# EAGLE design 902_kerberos (EAGLE 8.2.2)
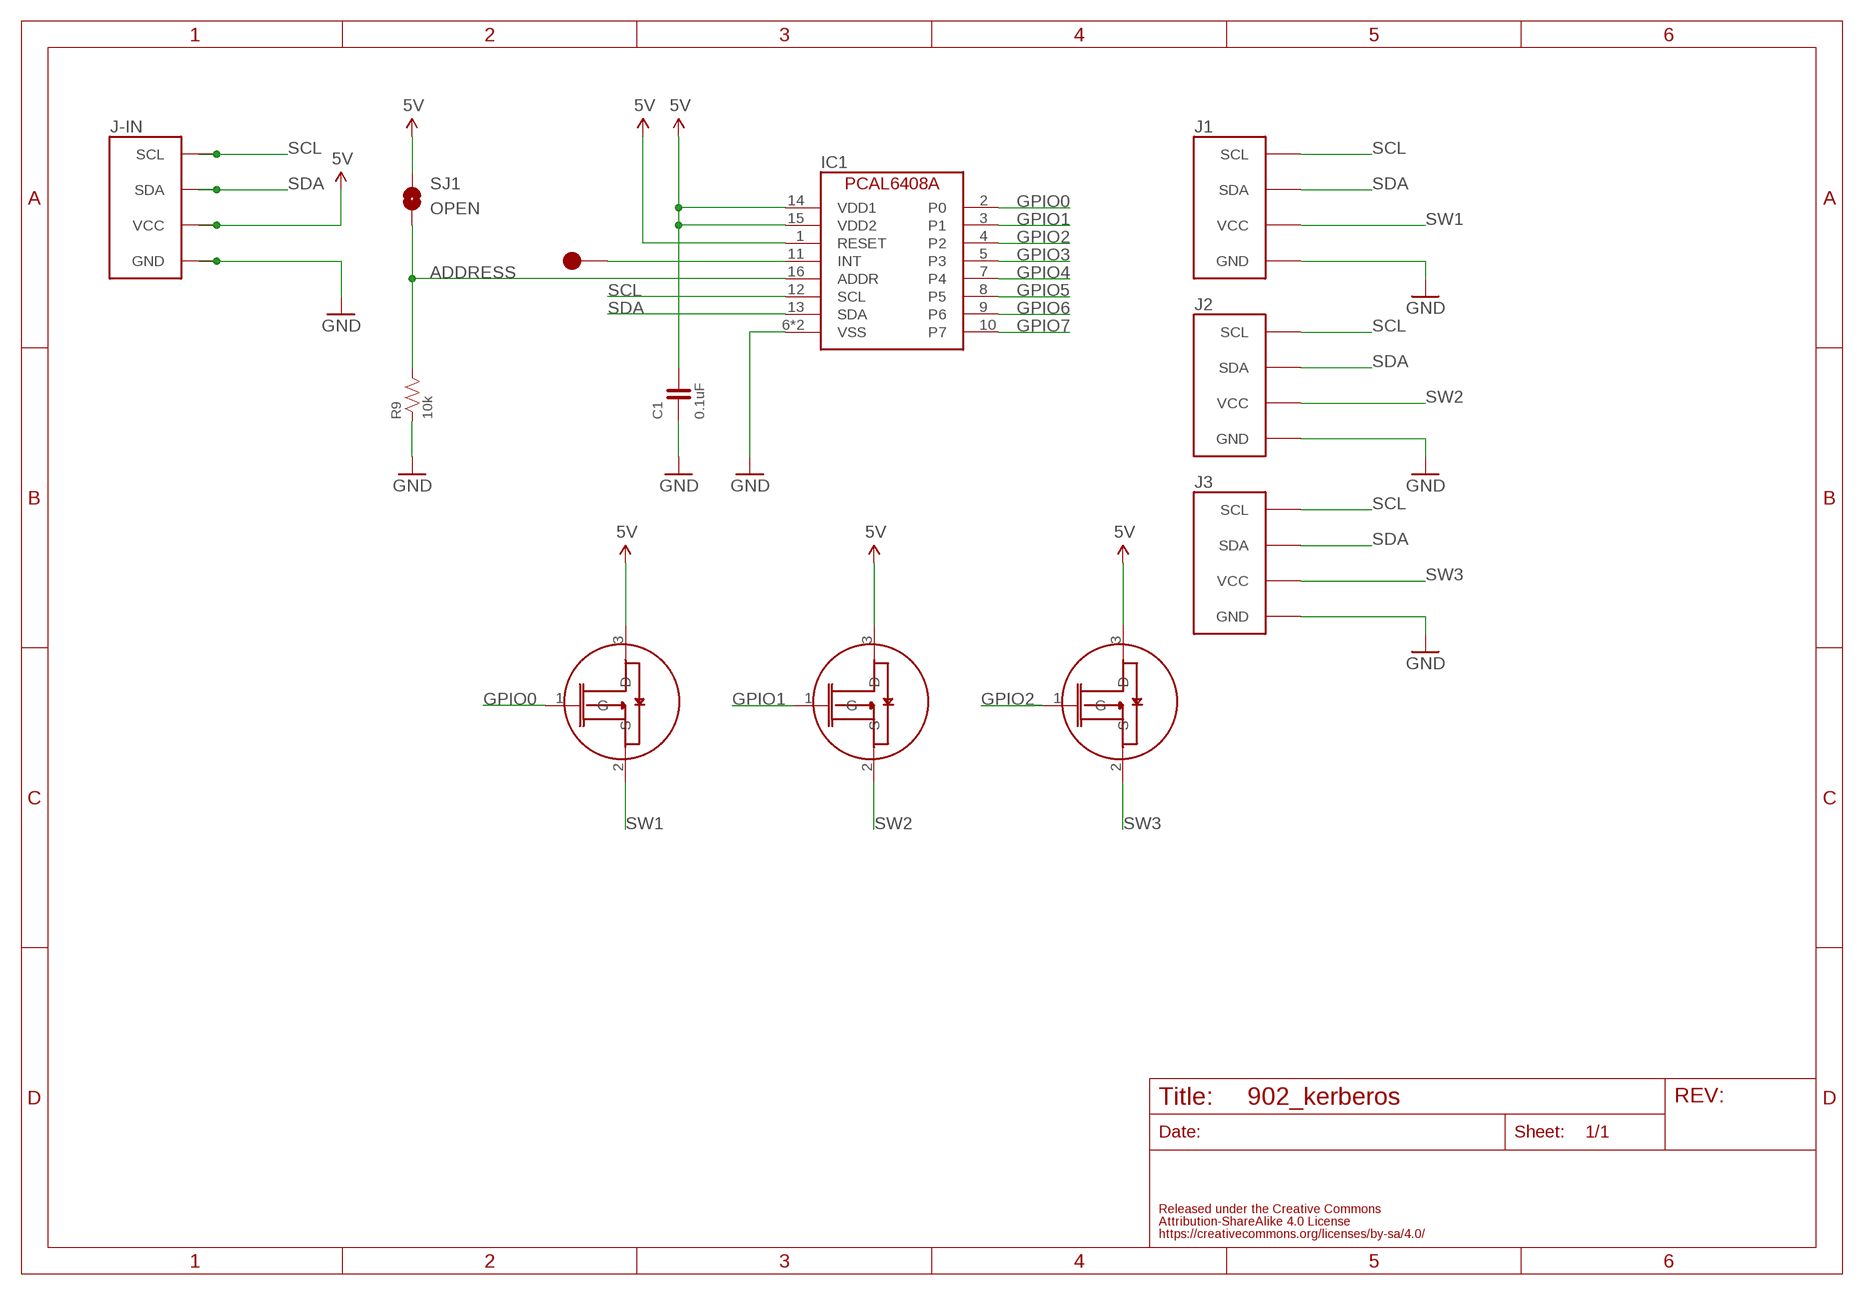
[diagram p0: schematic, sheet 1]

## Parts
C1  0.1uF  CAPACITOR-0603  [0603]
IC1  NX-PCAL6408A  [NXP-PCAL6408A]
J1  FABO_BRICK_I2C-S04B-PASK-2  [FABO_BRICK_I2C_S04B-PASK-2]
J2  FABO_BRICK_I2C-S04B-PASK-2  [FABO_BRICK_I2C_S04B-PASK-2]
J3  FABO_BRICK_I2C-S04B-PASK-2  [FABO_BRICK_I2C_S04B-PASK-2]
J-IN  FABO_BRICK_I2C-S04B-PASK-2  [FABO_BRICK_I2C_S04B-PASK-2]
R9  10k  RESISTOR-0603-NARROW  [0603-NARROW]
SJ1  OPEN  SMD-JUMPER-2-OPEN  [SMD-JUMPER-2-OPEN]
SW1  FAIRCHILD-FDN338  [SOT23]
SW2  FAIRCHILD-FDN338  [SOT23]
SW3  FAIRCHILD-FDN338  [SOT23]
TP1  TP-15  [TP-15]

## Nets
5V: C1.2 IC1.1(RESET) IC1.14(VDD1) IC1.15(VDD2) J-IN.VCC SJ1.1 SW1.3(D) SW2.3(D) SW3.3(D)
ADDRESS: IC1.16(ADDR) R9.2 SJ1.2
GND: C1.1 IC1.6(VSS) IC1.17(VSS) J1.GND J3.GND J-IN.GND R9.1
GPIO0: IC1.2(P0) SW1.1(G)
GPIO1: IC1.3(P1) SW2.1(G)
GPIO2: IC1.4(P2) SW3.1(G)
GPIO3: IC1.5(P3)
GPIO4: IC1.7(P4)
GPIO5: IC1.8(P5)
GPIO6: IC1.9(P6)
GPIO7: IC1.10(P7)
INT: IC1.11(INT) TP1.1
N$4: J2.GND ; supply symbol labelled GND
SCL: IC1.12(SCL) J1.SCL J2.SCL J3.SCL J-IN.SCL
SDA: IC1.13(SDA) J1.SDA J2.SDA J3.SDA J-IN.SDA
SW1: J1.VCC SW1.2(S)
SW2: J2.VCC SW2.2(S)
SW3: J3.VCC SW3.2(S)

## Library data of the parts
C1 = FaBo-Capacitor:CAPACITOR: CAPACITOR
IC1 = FaBo-Mems:NX-PCAL6408A: NXP PCAL6408A
J1-J3 J-IN = FaBo-Template:FABO_BRICK_I2C: FaBo Brick I2C
R9 = FaBo-Resistors:RESISTOR: RESISTOR
SJ1 = FaBo-Supply:SMD-JUMPER-2
SW1-SW3 = FaBo-Parts:FAIRCHILD-FDN338
TP1 = FaBo-Supply:TP

## Board
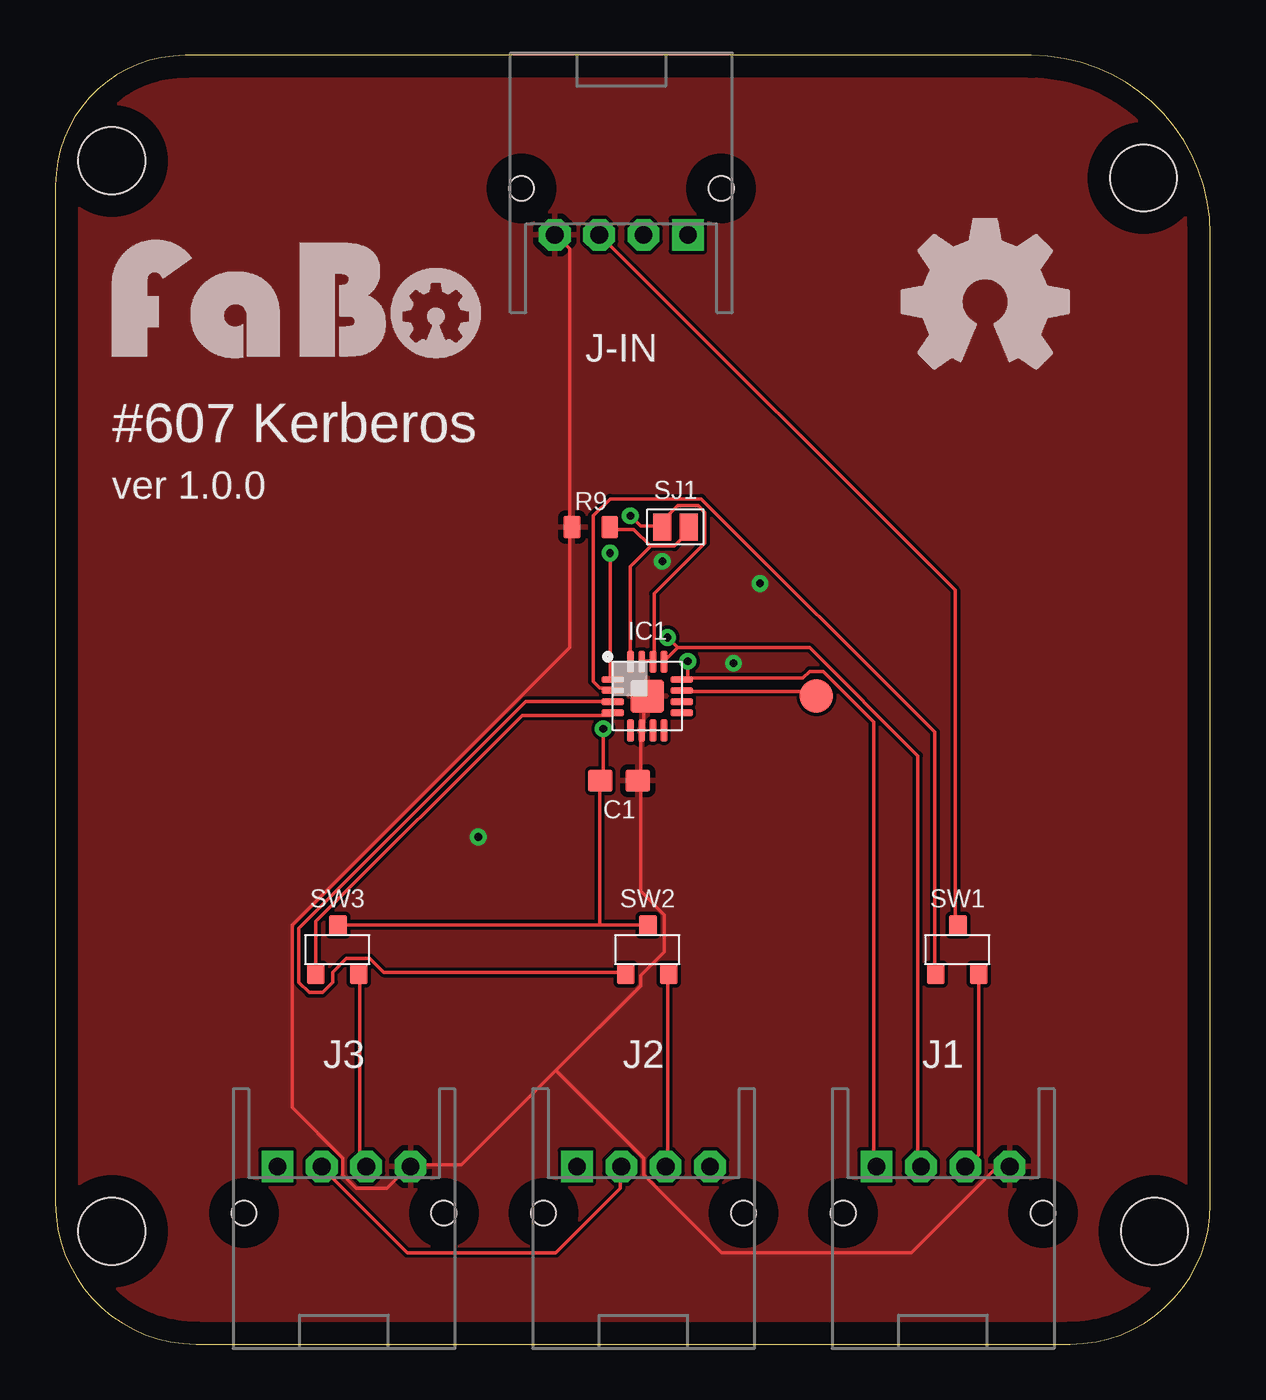
[diagram p1: board, top side]
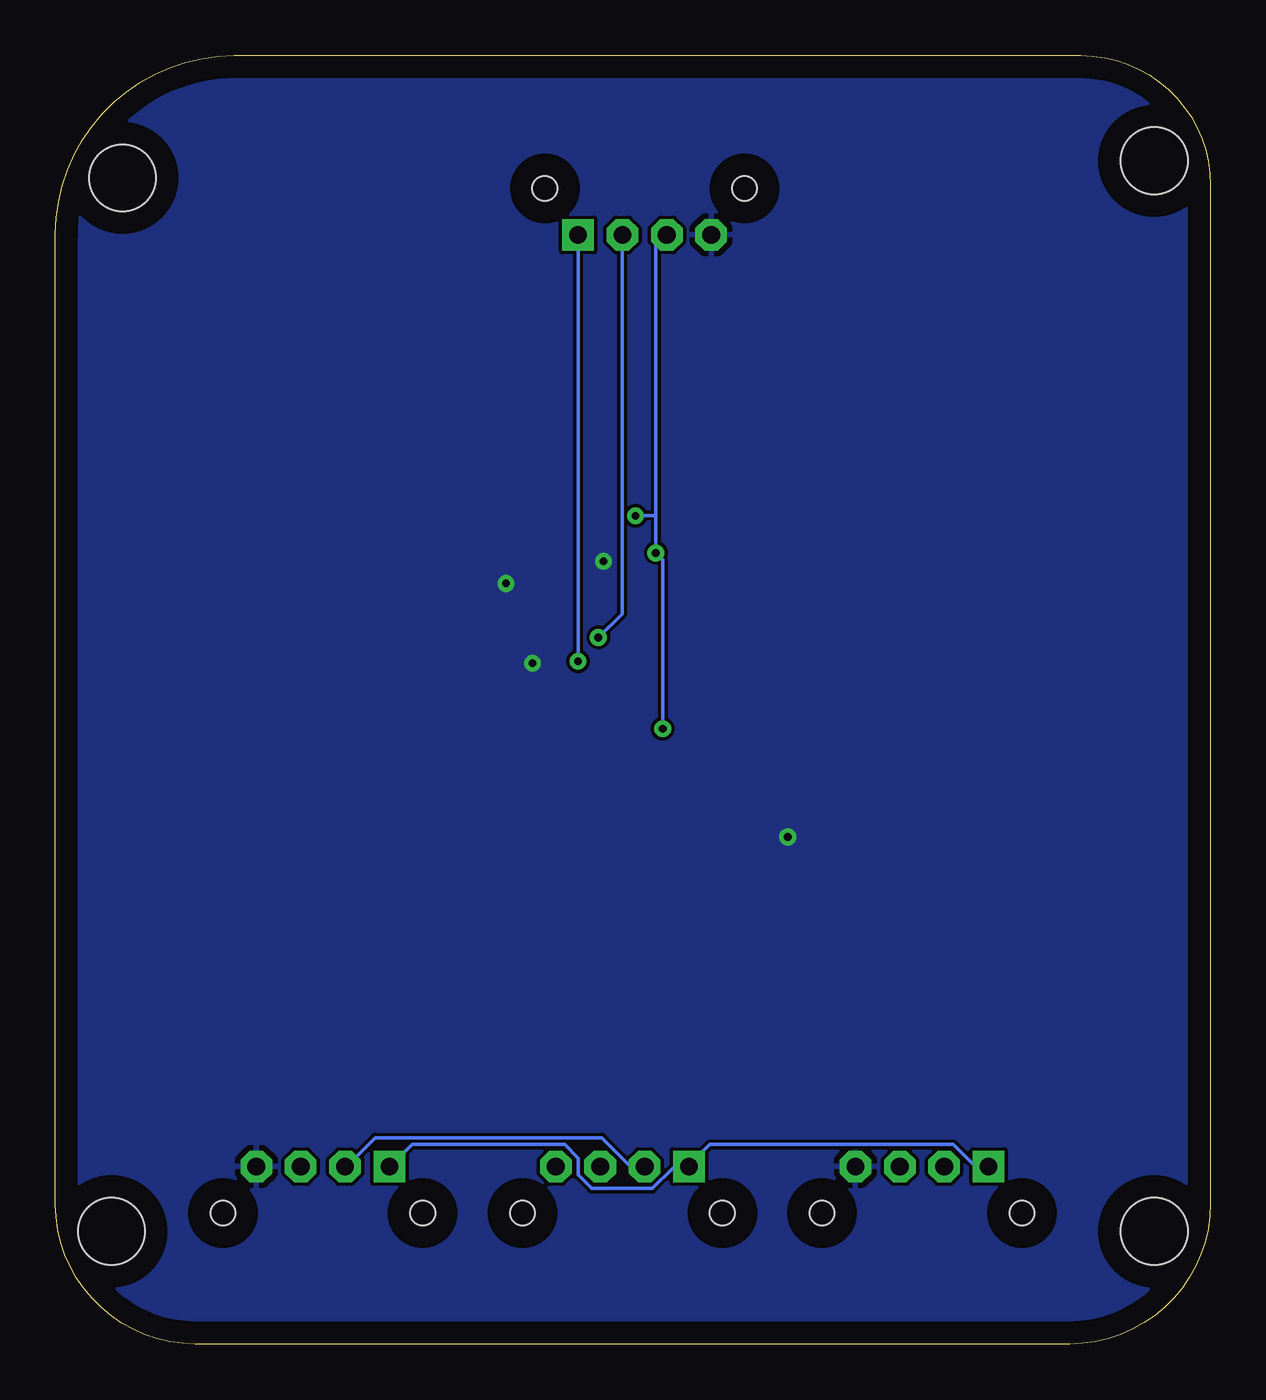
[diagram p2: board, bottom side, seen from below]

Size 52.05 x 58.09 mm. Coordinates in mm from the lower left corner, seen from the top.
Outline: 0,52.24 0,6.35 arc90 6.35,0 45.74,0 arc90 52.05,6.31 52.05,50.02 arc90 43.98,58.09 5.85,58.09 arc90 0,52.24
Copper layers (1*16): Top 0.035mm / dielectric 1.5mm / Bottom 0.035mm
Design rules "default": minimum track width 6mil, minimum drill 0.35mm, track to track 6mil, track to pad 6mil, pad to pad 6mil, via to via 6mil, smd to smd 6mil, copper to edge 40mil, drill to drill 6mil, minimum pad ring 10mil, minimum via ring 8mil, stop-mask expansion 4mil, vias tented up to drill 0mil, thermal gap 10mil
Holes 3 mm at 2.54,53.34 49.03,52.57 49.53,5.08 2.54,5.08

### Footprints (pad centres in the part's own frame; a part is rotated, then mirrored left to right if it is on the bottom)
0603 = smd 1.1 x 1: 1 -0.85,0; 2 0.85,0
NXP-PCAL6408A = smd 1 x 0.3: 1 -1.55,0.75; 2 -1.55,0.25; 3 -1.55,-0.25; 4 -1.55,-0.75; 9 1.55,-0.75; 10 1.55,-0.25; 11 1.55,0.25; 12 1.55,0.75 | smd 0.3 x 1: 5 -0.75,-1.55; 6 -0.25,-1.55; 7 0.25,-1.55; 8 0.75,-1.55; 13 0.75,1.55; 14 0.25,1.55; 15 -0.25,1.55; 16 -0.75,1.55 | smd 1.5 x 1.5: 17 0,0
FABO_BRICK_I2C_S04B-PASK-2 = drill 0.8 pad 1.422 octagon: GND -3,0; SDA 1,0; VCC -1,0 | drill 0.8 pad 1.422 square: SCL 3,0 | hole 1.1: 4.5,2.1; -4.5,2.1
0603-NARROW = smd 0.75 x 1: 1 -0.85,0; 2 0.85,0
SMD-JUMPER-2-OPEN = smd 0.8 x 1.2: 1 -0.6,0; 2 0.6,0
SOT23 = smd 0.8 x 0.9: 1 -0.97,-1.1; 2 0.97,-1.1; 3 0.03,1.1
TP-15 = smd 1.5 x 1.5: 1 0,0

### Placement (x,y rotation side)
C1  25.4,25.4 180 top
IC1  26.67,29.21 0 top
J1  40,8 180 top
J2  26.5,8 180 top
J3  13,8 180 top
J-IN  25.5,50 0 top
R9  24.13,36.83 0 top
SJ1  27.94,36.83 0 top
SW1  40.64,17.78 0 top
SW2  26.67,17.78 0 top
SW3  12.7,17.78 0 top
TP1  34.29,29.21 0 top
U$2  [LOGO_FABO_L]  10.16,44.45 0 top
U$3  [LOGO_OSHW_L]  41.91,46.99 0 top

### Tracks (layer width: path | path; a pad name or v marks a point on that pad's centre or on a via)
5V  (via drill 0.35)
  Top 0.152: 24.54,18.9 26.67,18.9 SW2.3 | 24.54,18.9 12.8,18.9 SW3.3 | 24.54,18.9 24.54,25.3 C1.2 24.69,25.45 v24.69,27.74 | IC1.15 26.52,30.79 26.82,30.79 IC1.14 26.98,30.79 26.98,33.83 29.26,36.12 29.26,37.49 28.96,37.8 28.04,37.8 27.43,37.19 27.43,36.88 SJ1.1 27.28,36.88 26.36,36.88 v25.91,37.34 | SW1.3 40.54,18.9 40.54,33.98 24.54,49.99 J-IN.VCC | v24.99,35.66 24.99,30.02 IC1.1
  Bottom 0.152: 24.99,37.34 24.99,49.53 24.54,49.99 J-IN.VCC | 24.99,37.34 v24.99,35.66 24.69,35.36 v24.69,27.74 | 24.99,37.34 v25.91,37.34
ADDRESS
  Top 0.152: 26.82,35.97 26.06,36.73 24.99,36.73 R9.2 | 26.82,35.97 27.89,35.97 28.65,36.73 SJ1.2 | 26.82,35.97 25.91,35.05 25.91,30.79 IC1.16
GND  (via drill 0.35)
  Top 0.152: J-IN.GND 22.55,49.99 23.16,49.38 23.16,36.88 R9.1 23.16,36.73 23.16,31.39 10.67,18.9 10.67,10.67 12.95,8.38 12.95,7.62 13.56,7.01 14.94,7.01 15.85,7.92 J3.GND 16,8.08 18.29,8.08 22.55,12.34 | IC1.17 26.67,29.11 26.52,28.96 26.52,27.74 IC1.6 26.36,27.58 26.36,25.45 C1.1 26.36,25.3 26.36,20.42 27.43,19.36 27.43,17.68 26.36,16.61 26.36,16.15 22.55,12.34 | 22.55,12.34 26.52,8.38 26.52,7.62 30.02,4.12 38.56,4.12 42.37,7.92 42.98,7.92 J1.GND
  other vias: 19.05,22.86 31.75,34.29 27.35,35.29 30.55,30.69
  pour Bottom: 0,0 52.07,0 52.07,58.42 0,58.42
  pour Top: 0,0 52.07,0 52.07,58.42 0,58.42
GPIO0
  Top 0.152: SW1.1 39.62,16.76 39.62,27.58 29.11,38.1 24.99,38.1 24.23,37.34 24.23,29.87 24.54,29.57 24.99,29.57 IC1.2
GPIO1
  Top 0.152: SW2.1 25.6,16.76 14.78,16.76 14.17,17.37 13.11,17.37 12.5,16.76 12.5,16.31 12.04,15.85 11.43,15.85 10.97,16.31 10.97,18.75 21.18,28.96 24.99,28.96 IC1.3
GPIO2
  Top 0.152: SW3.1 11.73,16.76 11.73,19.05 21.03,28.35 24.99,28.35 IC1.4
INT
  Top 0.152: IC1.11 28.35,29.41 34.14,29.41 34.29,29.26 TP1.1
SCL  (via drill 0.35)
  Top 0.152: 28.5,30.02 33.68,30.02 33.98,30.33 34.59,30.33 36.88,28.04 36.88,8.08 J1.SCL | 28.5,30.02 28.35,30.02 IC1.12 28.5,30.02 | 28.5,30.02 v28.5,30.79
  Bottom 0.152: J3.SCL 10.06,8.08 10.67,8.08 11.58,8.99 22.55,8.99 23.47,8.08 J2.SCL 23.62,7.92 24.23,7.92 25.15,7.01 27.89,7.01 28.5,7.62 28.5,8.38 29.11,8.99 35.97,8.99 36.88,8.08 J1.SCL | v28.5,30.79 28.5,49.99 J-IN.SCL
SDA  (via drill 0.35)
  Top 0.152: J3.SDA 12.04,7.92 15.85,4.12 22.55,4.12 25.45,7.01 25.45,7.92 J2.SDA | 28.04,31.39 27.43,30.79 IC1.13 | 28.04,31.39 33.98,31.39 38.86,26.52 38.86,8.08 J1.SDA | 28.04,31.39 v27.58,31.85
  Bottom 0.152: v27.58,31.85 26.52,32.92 26.52,49.99 J-IN.SDA | J2.SDA 25.6,8.08 26.21,8.08 27.43,9.3 37.64,9.3 38.86,8.08 J1.SDA
SW1
  Top 0.152: SW1.2 41.6,16.61 41.6,8.53 41.15,8.08 J1.VCC
SW2
  Top 0.152: SW2.2 27.58,16.61 27.58,8.08 J2.VCC
SW3
  Top 0.152: SW3.2 13.72,16.61 13.72,8.23 13.87,8.08 J3.VCC

### Text on the board
tPlace: #607 Kerberos | ver 1.0.0